# EAGLE schematic ME433_SCH1 (EAGLE 9.3.0)
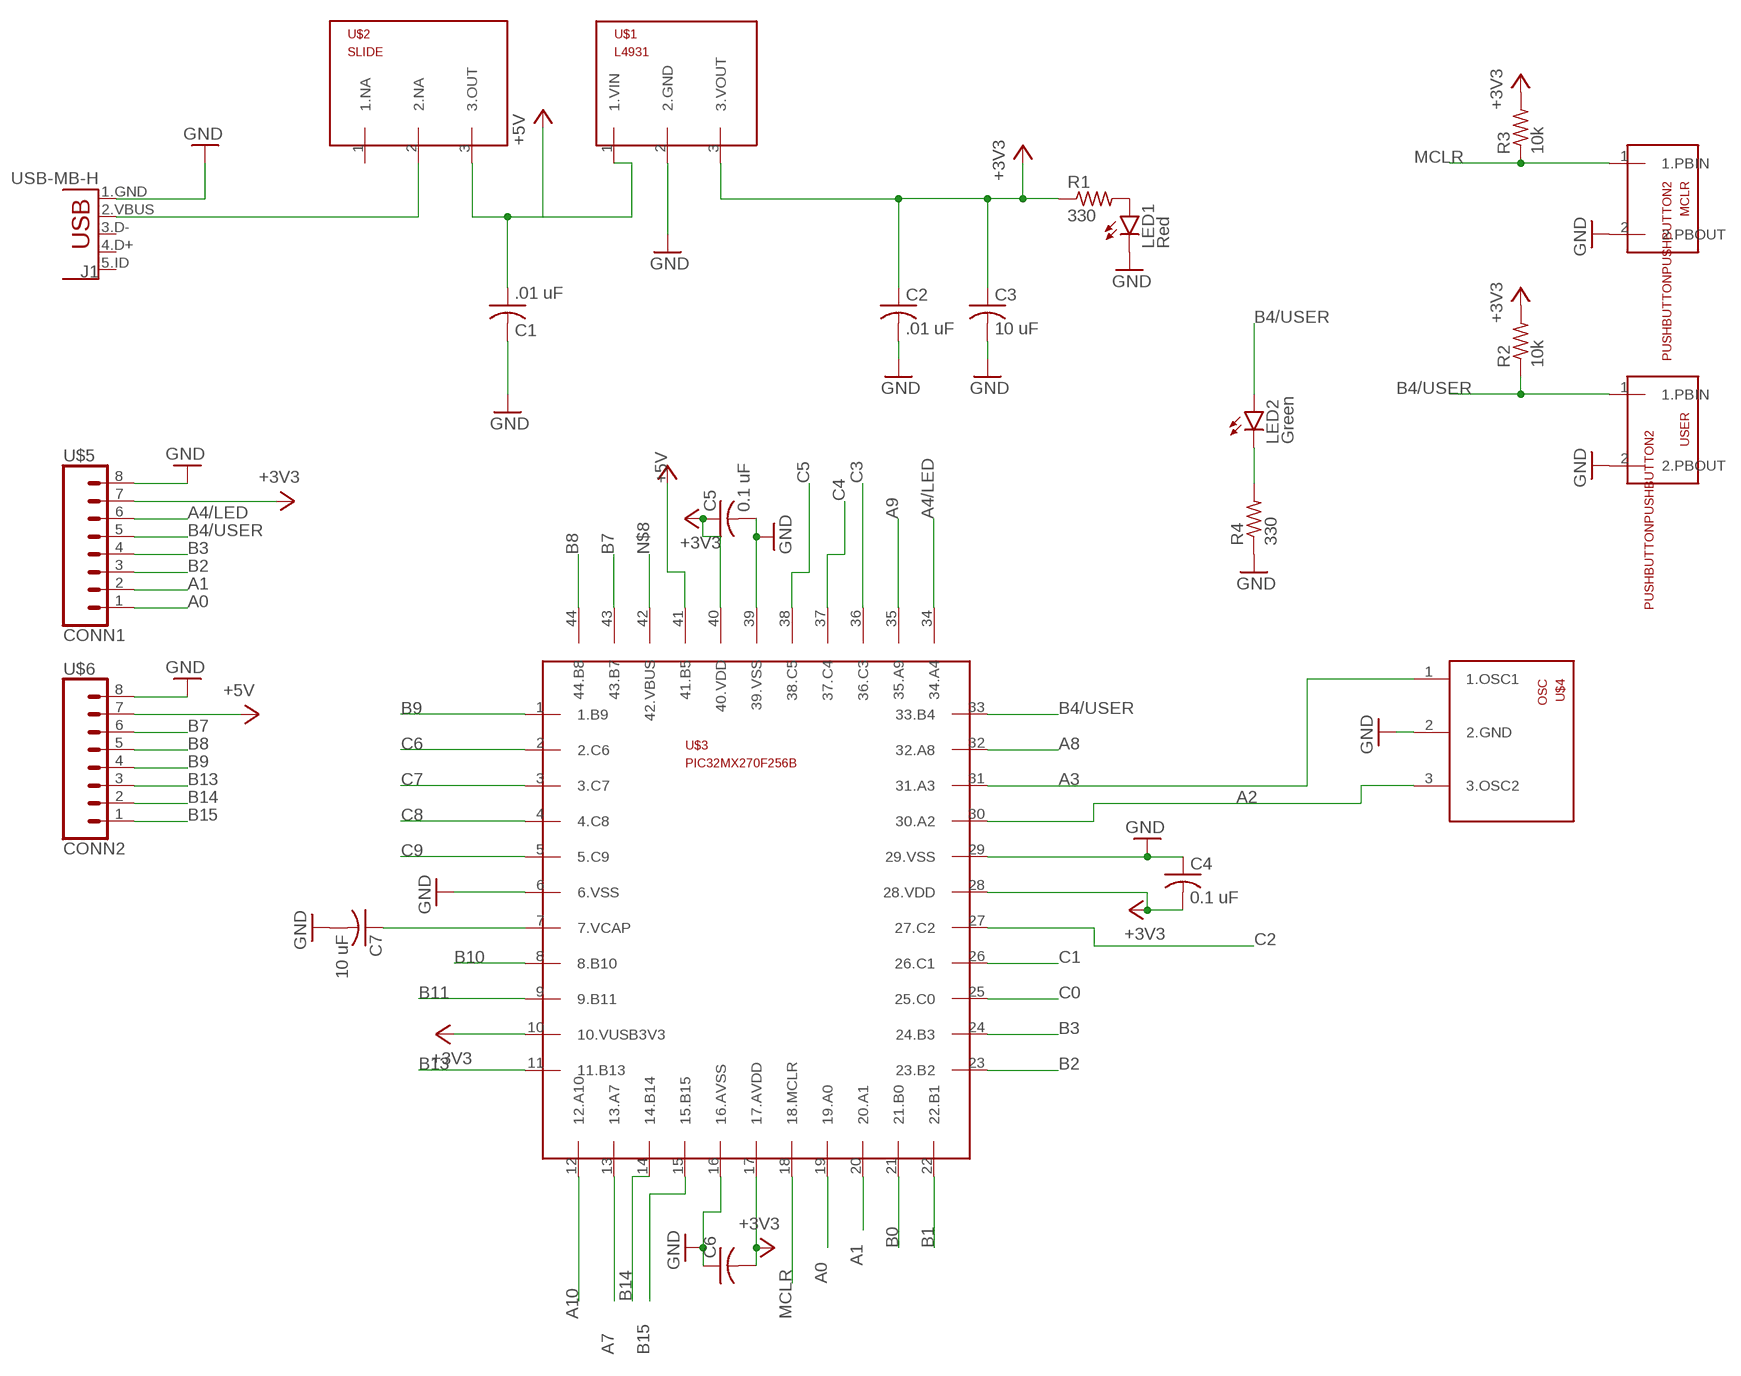
[diagram p0: schematic, sheet 1]

## Parts
C1  .01 uF  C-US050-024X044  [C050-024X044]
C2  .01 uF  C-US050-024X044  [C050-024X044]
C3  10 uF  C-US050-024X044  [C050-024X044]
C4  0.1 uF  C-US050-024X044  [C050-024X044]
C5  0.1 uF  C-US050-024X044  [C050-024X044]
C6  C-US050-024X044  [C050-024X044]
C7  10 uF  C-US050-024X044  [C050-024X044]
J1  USB-MB-H  [USB-MB-H]
LED1  Red  LED3MM  [LED3MM]
LED2  Green  LED3MM  [LED3MM]
MCLR  PUSHBUTTONPUSHBUTTON2  [PUSHBUTTON]
R1  330  R-US_0207/10  [0207/10]
R2  10k  R-US_0207/10  [0207/10]
R3  10k  R-US_0207/10  [0207/10]
R4  330  R-US_0207/10  [0207/10]
U$1  L4931  [TO92]
U$2  SLIDE  [SLIDE]
U$3  PIC32MX270F256B  [TQFP44]
U$4  OSC  [OSC]
U$5  CONN1  [CONN1]
U$6  CONN2  [CONN1]
USER  PUSHBUTTONPUSHBUTTON2  [PUSHBUTTON]

## Nets
+3V3: C2.1 C3.1 C4.2 C5.1 C6.2 R1.1 R2.2 R3.2 U$1.3(3.VOUT) U$3.10(10.VUSB3V3) U$3.17(17.AVDD) U$3.28(28.VDD) U$3.40(40.VDD) U$5.7(7.3V3)
+5V: C1.1 U$1.1(1.VIN) U$2.3(3.OUT) U$3.41(41.B5) U$6.7(7.5V)
A0: U$3.19(19.A0) U$5.1(1.A0)
A1: U$3.20(20.A1) U$5.2(2.A1)
A2: U$3.30(30.A2) U$4.3(3.OSC2)
A3: U$3.31(31.A3) U$4.1(1.OSC1)
A4/LED: U$3.34(34.A4) U$5.6(6.A4)
A7: U$3.13(13.A7)
A8: U$3.32(32.A8)
A9: U$3.35(35.A9)
A10: U$3.12(12.A10)
B0: U$3.21(21.B0)
B1: U$3.22(22.B1)
B2: U$3.23(23.B2) U$5.3(3.B2)
B3: U$3.24(24.B3) U$5.4(4.B3)
B4/USER: LED2.A R2.1 U$3.33(33.B4) U$5.5(5.B4) USER.1(1.PBIN)
B7: U$3.43(43.B7) U$6.6(6.B7)
B8: U$3.44(44.B8) U$6.5(5.B8)
B9: U$3.1(1.B9) U$6.4(4.B9)
B10: U$3.8(8.B10)
B11: U$3.9(9.B11)
B13: U$3.11(11.B13) U$6.3(3.B13)
B14: U$3.14(14.B14) U$6.2(2.B14)
B15: U$3.15(15.B15) U$6.1(1.B15)
C0: U$3.25(25.C0)
C1: U$3.26(26.C1)
C2: U$3.27(27.C2)
C3: U$3.36(36.C3)
C4: U$3.37(37.C4)
C5: U$3.38(38.C5)
C6: U$3.2(2.C6)
C7: U$3.3(3.C7)
C8: U$3.4(4.C8)
C9: U$3.5(5.C9)
GND: C1.2 C2.2 C3.2 C4.1 C5.2 C6.1 C7.2 J1.1.GND LED1.K(C) MCLR.2(2.PBOUT) R4.1 U$1.2(2.GND) U$3.6(6.VSS) U$3.16(16.AVSS) U$3.29(29.VSS) U$3.39(39.VSS) U$4.2(2.GND) U$5.8(8.GND) U$6.8(8.GND) USER.2(2.PBOUT)
MCLR: MCLR.1(1.PBIN) R3.1 U$3.18(18.MCLR)
N$1: J1.2.VBUS U$2.2(2.NA)
N$2: C7.1 U$3.7(7.VCAP)
N$3: LED1.A R1.2
N$5: LED2.K(C) R4.2
N$8: U$3.42(42.VBUS)
Unconnected: J1.3.D- J1.4.D+ J1.5.ID U$2.1(1.NA)

## Library data of the parts
C1-C7 = ME433_PCB1lib:C-US: CAPACITOR, American symbol; SPICEPREFIX: C
J1 = ME433_PCB1lib:USB: USB Connectors USB-B-PTH is fully proven SKU : PRT-00139/CONN-08278 USB-miniB is fully proven SKU : PRT-00587 USB-A-PCB is untested. USB-A-H is throughly reviewed, but untested. Spark Fun Electronics SKU : PRT-00437 USB-B-SMT is throughly reviewed, but untested. Needs silkscreen touching up. USB-A-S has not been used/tested USB-MB-H has not been used/tested USB-MICROB has been used. CONN-09505
LED1 LED2 = ME433_PCB1lib:LED: LED OSRAM: - CHIPLED LG R971, LG N971, LY N971, LG Q971, LY Q971, LO R971, LY R971 LH N974, LH R974 LS Q976, LO Q976, LY Q976 LO Q996 - Hyper CHIPLED LW Q18S LB Q993, LB Q99A, LB R99A - SideLED LS A670, LO A670, LY A670, LG A670, LP A670 LB A673, LV A673, LT A673, LW A673 LH A674 LY A675 LS A676, LA A676, LO A676, LY A676, LW A676 LS A679, LY A679, LG A679 - Hyper Micro SIDELED® LS Y876, LA Y876, LO Y876, LY Y876 LT Y87S - SmartLED LW L88C, LW L88S LB L89C, LB L89S, LG L890 LS L89K, LO L89K, LY L89K LS L896, LA L896, LO L896, LY L896 - TOPLED LS T670, LO T670, LY T670, LG T670, LP T670 LSG T670, LSP T670, LSY T670, LOP T670, LYG T670 LG T671, LOG T671, LSG T671 LB T673, LV T673, LT T673, LW T673 LH T674 LS T676, LA T676, LO T676, LY T676, LB T676, LH T676, LSB T676, LW T676 LB T67C, LV T67C, LT T67C, LS T67K, LO T67K, LY T67K, LW E67C LS E67B, LA E67B, LO E67B, LY E67B, LB E67C, LV E67C, LT E67C LW T67C LS T679, LY T679, LG T679 LS T770, LO T770, LY T770, LG T770, LP T770 LB T773, LV T773, LT T773, LW T773 LH T774 LS E675, LA E675, LY E675, LS T675 LS T776, LA T776, LO T776, LY T776, LB T776 LHGB T686 LT T68C, LB T68C - Hyper Mini TOPLED® LB M676 - Mini TOPLED Santana® LG M470 LS M47K, LO M47K, LY M47K Source: http://www.osram.convergy.de LUXEON: - LUMILED® LXK2-PW12-R00, LXK2-PW12-S00, LXK2-PW14-U00, LXK2-PW14-V00 LXK2-PM12-R00, LXK2-PM12-S00, LXK2-PM14-U00 LXK2-PE12-Q00, LXK2-PE12-R00, LXK2-PE12-S00, LXK2-PE14-T00, LXK2-PE14-U00 LXK2-PB12-K00, LXK2-PB12-L00, LXK2-PB12-M00, LXK2-PB14-N00, LXK2-PB14-P00, LXK2-PB14-Q00 LXK2-PR12-L00, LXK2-PR12-M00, LXK2-PR14-Q00, LXK2-PR14-R00 LXK2-PD12-Q00, LXK2-PD12-R00, LXK2-PD12-S00 LXK2-PH12-R00, LXK2-PH12-S00 LXK2-PL12-P00, LXK2-PL12-Q00, LXK2-PL12-R00 Source: www.luxeon.com KINGBRIGHT: KA-3528ASYC Source: www.kingbright.com
MCLR USER = ME433_PCB1lib:PUSHBUTTON
R1-R4 = ME433_PCB1lib:R-US_: RESISTOR, American symbol; SPICEPREFIX: R
U$1 = ME433_PCB1lib:L4931
U$2 = ME433_PCB1lib:SLIDE
U$3 = ME433_PCB1lib:PIC32MX270F256B
U$4 = ME433_PCB1lib:OSC
U$5 = ME433_PCB1lib:CONN1
U$6 = ME433_PCB1lib:CONN2